# EAGLE schematic Digital-receiver (EAGLE 8.5.2)
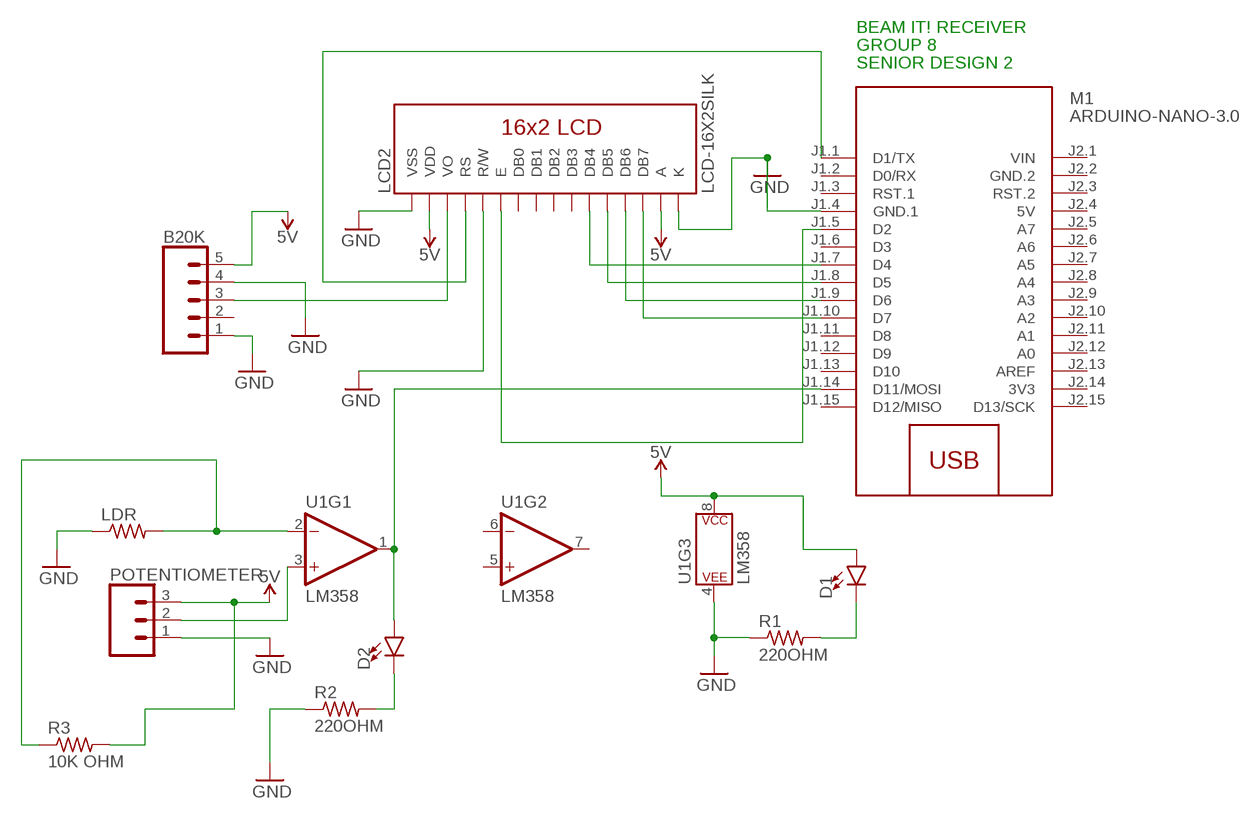
[diagram p0: schematic, sheet 1]

## Parts
B20K  CONN_05  [1X05]
D1  LED3MM  [LED_3MM]
D2  LED3MM  [LED_3MM]
LCD2  LCD-16X2SILK  [LCD-16X2]
LDR  R-US_0204/7  [0204/7]
M1  ARDUINO-NANO-3.0  [ARDUINO-NANO-3.0]
POTENTIOMETER  CONN_03  [1X03]
R1  220OHM  R-US_0204/7  [0204/7]
R2  220OHM  R-US_0204/7  [0204/7]
R3  10K OHM  R-US_0204/7  [0204/7]
U1  LM358  [DIP08]

## Nets
5V: B20K.5 D1.A LCD2.2(VDD) POTENTIOMETER.3 R3.2 U1.8(P$V+)
GND: B20K.1 B20K.4 LCD2.1(VSS) LCD2.5(R/W) LCD2.16(K) LDR.1 M1.J1.4(GND.1) POTENTIOMETER.1 R1.1 R2.1 U1.4(P$V-)
N$1: B20K.3 LCD2.3(VO)
N$2: LCD2.4(RS) M1.J1.1(D1/TX)
N$3: LCD2.6(E) M1.J1.5(D2)
N$4: LCD2.11(DB4) M1.J1.7(D4)
N$5: LCD2.12(DB5) M1.J1.8(D5)
N$6: LCD2.13(DB6) M1.J1.9(D6)
N$7: LCD2.14(DB7) M1.J1.10(D7)
N$8: D2.A M1.J1.14(D11/MOSI) U1.1(OUT)
N$9: D2.K(C) R2.2
N$10: LDR.2 R3.1 U1.2(-IN)
N$11: POTENTIOMETER.2 U1.3(+IN)
N$12: D1.K(C) R1.2
N$13: LCD2.15(A)
Unconnected: B20K.2 LCD2.7(DB0) LCD2.8(DB1) LCD2.9(DB2) LCD2.10(DB3) M1.J1.2(D0/RX) M1.J1.3(RST.1) M1.J1.6(D3) M1.J1.11(D8) M1.J1.12(D9) M1.J1.13(D10) M1.J1.15(D12/MISO) M1.J2.3(RST.2) M1.J2.5(A7) M1.J2.6(A6) M1.J2.7(A5) M1.J2.8(A4) M1.J2.9(A3) M1.J2.10(A2) M1.J2.11(A1) M1.J2.12(A0) M1.J2.13(AREF) M1.J2.15(D13/SCK) U1.5(+IN) U1.6(-IN) U1.7(OUT)

## Notes on the sheet
- BEAM IT! RECEIVER
- GROUP 8
- SENIOR DESIGN 2

## Power pins joined to a net without a drawn wire
3V3: M1.J2.14(3V3)
5V: M1.J2.4(5V)
GND.2: M1.J2.2(GND.2)
VIN: M1.J2.1(VIN)

## Library data of the parts
B20K = SparkFun-Connectors:CONN_05: Multi connection point. Often used as Generic Header-pin footprint for 0.1 inch spaced/style header connections On any of the 0.1 inch spaced packages, you can populate with these: Break Away Headers - Straight <https://www.sparkfun.com/products/116> (PRT-00116) Break Away Male Headers - Right Angle <https://www.sparkfun.com/products/553> (PRT-00553) Female Headers <https://www.sparkfun.com/products/115> (PRT-00115) Break Away Headers - Machine Pin <https://www.sparkfun.com/products/117> (PRT-00117) Break Away Female Headers - Swiss Machine Pin <https://www.sparkfun.com/products/743> (PRT-00743) For SCREWTERMINALS and SPRING TERMINALS visit here: Screw Terimnals on SparkFun.com <https://www.sparkfun.com/search/results?term=Screw+Terminals> (5mm/3.5mm/2.54mm spacing) This device is also useful as a general connection point to wire up your design to another part of your project. Our various solder wires solder well into these plated through hole pads. Hook-Up Wire - Assortment (Stranded, 22 AWG) <https://www.sparkfun.com/products/11375> (PRT-11375) Hook-Up Wire - Assortment (Solid Core, 22 AWG) <https://www.sparkfun.com/products/11367> (PRT-11367) View the entire wire category on our website here <https://www.sparkfun.com/categories/141> Special notes: Molex polarized connector foot print use with SKU : PRT-08231 with associated crimp pins and housings. 1MM SMD Version SKU: PRT-10208
D1 D2 = SparkFun-LED:LED: LED (Generic) Standard schematic elements and footprints for 5mm, 3mm, 1206, and 0603 sized LEDs. Generic LEDs with no color specified.; PROD_ID: DIO-08794
LCD2 = SparkFun-Displays:LCD-16X2: Standard text-only 16x2 parallel input LCD Basic 16 character by 2 line display. Typically utilizes the extremely common HD44780 parallel interface chipset SparkFun Products: Basic 16x2 Green <https://www.sparkfun.com/products/255> Basic 8x2 Green <https://www.sparkfun.com/products/11122>; SF_ID: LCD-00255
LDR R1-R3 = BeagleBone_Black_Wireless:R-US_: RESISTOR, American symbol
M1 = diy-modules:ARDUINO-NANO-3.0: Arduino Nano 3.0 and compatible devices More details available here: https://www.arduino.cc/en/Main/ArduinoBoardNano Click here to find device on ebay.com <http://www.ebay.com/sch/arduino+nano>
POTENTIOMETER = SparkFun-Connectors:CONN_03: Multi connection point. Often used as Generic Header-pin footprint for 0.1 inch spaced/style header connections On any of the 0.1 inch spaced packages, you can populate with these: Break Away Headers - Straight <https://www.sparkfun.com/products/116> (PRT-00116) Break Away Male Headers - Right Angle <https://www.sparkfun.com/products/553> (PRT-00553) Female Headers <https://www.sparkfun.com/products/115> (PRT-00115) Break Away Headers - Machine Pin <https://www.sparkfun.com/products/117> (PRT-00117) Break Away Female Headers - Swiss Machine Pin <https://www.sparkfun.com/products/743> (PRT-00743) Stackable Header - 3 Pin (Female, 0.1") <https://www.sparkfun.com/products/13875> (PRT-13875) For SCREWTERMINALS and SPRING TERMINALS visit here: Screw Terimnals on SparkFun.com <https://www.sparkfun.com/search/results?term=Screw+Terminals> (5mm/3.5mm/2.54mm spacing) This device is also useful as a general connection point to wire up your design to another part of your project. Our various solder wires solder well into these plated through hole pads. Hook-Up Wire - Assortment (Stranded, 22 AWG) <https://www.sparkfun.com/products/11375> (PRT-11375) Hook-Up Wire - Assortment (Solid Core, 22 AWG) <https://www.sparkfun.com/products/11367> (PRT-11367) View the entire wire category on our website here <https://www.sparkfun.com/categories/141> Special notes: Molex polarized connector foot print use with SKU : PRT-08232 with associated crimp pins and housings.
U1 = SparkFun-IC-Amplifiers:LM358: LM358 Jellybean op-amp Datasheet <http://www.sparkfun.com/datasheets/Components/General/LM358.pdf> SparkFun Products Op-Amp (Thru-Hole) - LM358 <https://www.sparkfun.com/products/9456> (COM-09456); PROD_ID: IC-09172